# EAGLE design I2CbusTesterV1.3b (EAGLE 5.06)
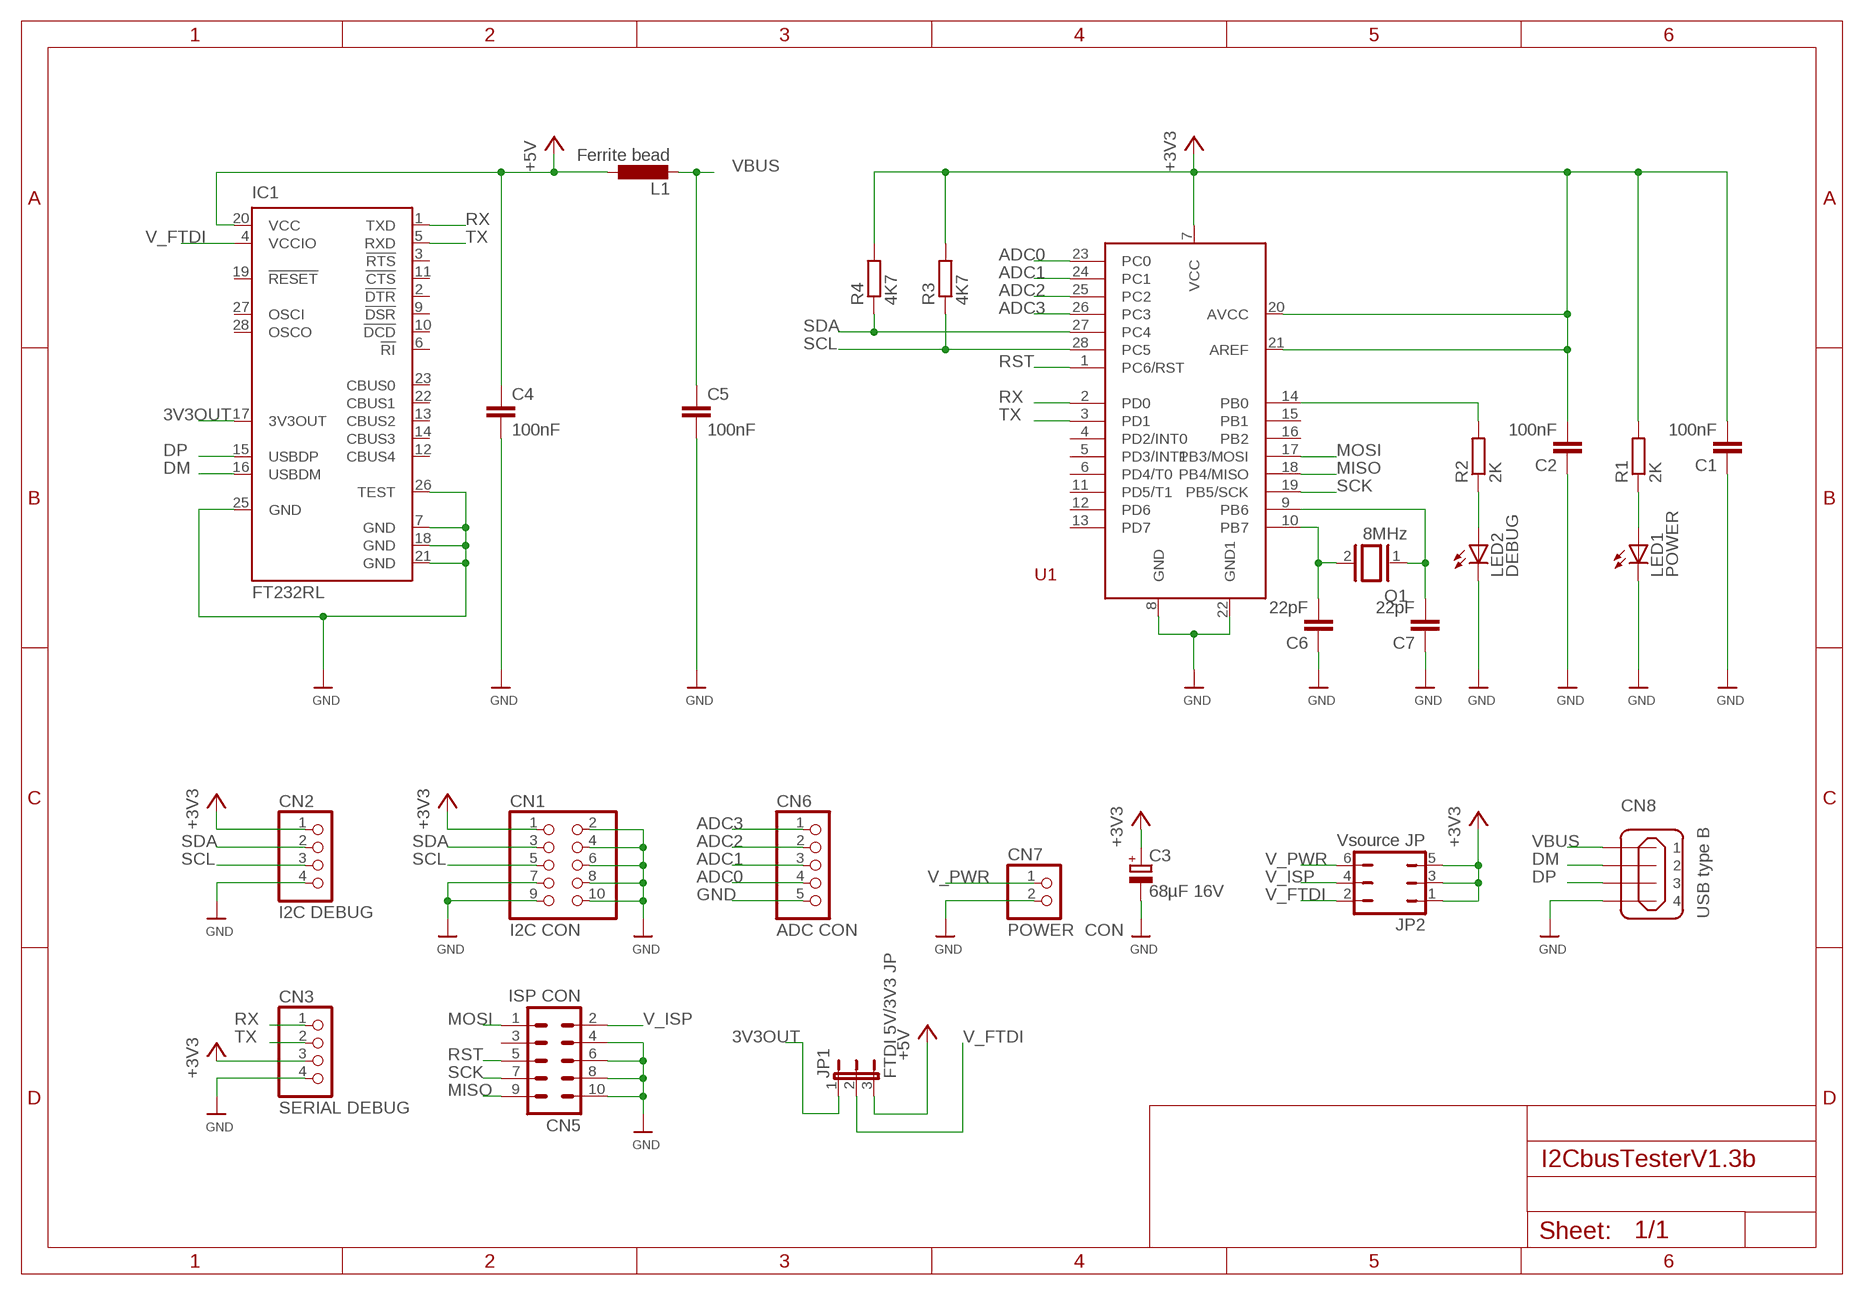
[diagram p0: schematic, sheet 1]

## Parts
C1  100nF  C-EU050-025X075  [C050-025X075]
C2  100nF  C-EU050-025X075  [C050-025X075]
C3  68µF 16V  CPOL-EUE2.5-6  [E2,5-6]
C4  100nF  C-EUC1206  [C1206]
C5  100nF  C-EUC1206  [C1206]
C6  22pF  C-EU025-025X050  [C025-025X050]
C7  22pF  C-EU025-025X050  [C025-025X050]
CN1  I2C CON  PIN1.27-2X5-  [2X05-TH1.27MM-LC]
CN2  I2C DEBUG  PINHD-1X4  [1X04]
CN3  SERIAL DEBUG  PINHD-1X4  [1X04]
CN5  ISP CON  ML10  [ML10]
CN6  ADC CON  PINHD-1X5  [1X05]
CN7  POWER CON  PINHD-1X2  [1X02]
CN8  USB type B  MINI-USB_4P-85-32004-10X  [85-32004-10X]
IC1  FT232RL  [SSOP28]
JP1  FTDI 5V/3V3 JP  JP2E  [JP2]
JP2  Vsource JP  JP3Q  [JP3Q]
L1  Ferrite bead  L-EU  [R0805W]
LED1  POWER  LED5MM  [LED5MM]
LED2  DEBUG  LED5MM  [LED5MM]
Q1  8MHz  XTAL/S  [QS]
R1  2K  R-EU_0207/10  [0207/10]
R2  2K  R-EU_0207/10  [0207/10]
R3  4K7  R-EU_0207/10  [0207/10]
R4  4K7  R-EU_0207/10  [0207/10]
U1  ATMEGA88  [AT28DIP]

## Nets
3V3OUT: IC1.17(3V3OUT) JP1.1
+3V3: C1.2 C2.2 C3.+ CN1.1 CN2.1 CN3.3 JP2.1 JP2.3 JP2.5 R1.2 R3.2 R4.2 U1.7(VCC) U1.20(AVCC) U1.21(AREF)
+5V: C4.1 IC1.20(VCC) JP1.3 L1.1
ADC0: CN6.4 U1.23(PC0)
ADC1: CN6.3 U1.24(PC1)
ADC2: CN6.2 U1.25(PC2)
ADC3: CN6.1 U1.26(PC3)
DM: CN8.2 IC1.16(USBDM)
DP: CN8.3 IC1.15(USBDP)
GND: C1.1 C2.1 C3.- C4.2 C5.2 C6.1 C7.1 CN1.2 CN1.4 CN1.6 CN1.7 CN1.8 CN1.9 CN1.10 CN2.4 CN3.4 CN5.4 CN5.6 CN5.8 CN5.10 CN6.5 CN7.2 CN8.4 IC1.7(GND) IC1.18(GND) IC1.21(GND) IC1.25(GND) IC1.26(TEST) LED1.K(C) LED2.K(C) U1.8(GND) U1.22(GND1)
MISO: CN5.9 U1.18(PB4/MISO)
MOSI: CN5.1 U1.17(PB3/MOSI)
N$2: C6.2 Q1.2 U1.10(PB7)
N$3: LED1.A R1.1
N$5: LED2.A R2.1
N$6: R2.2 U1.14(PB0)
N$9: C7.2 Q1.1 U1.9(PB6)
RST: CN5.5 U1.1(PC6/RST)
RX: CN3.1 IC1.1(TXD) U1.2(PD0)
SCK: CN5.7 U1.19(PB5/SCK)
SCL: CN1.5 CN2.3 R3.1 U1.28(PC5)
SDA: CN1.3 CN2.2 R4.1 U1.27(PC4)
TX: CN3.2 IC1.5(RXD) U1.3(PD1)
V_FTDI: IC1.4(VCCIO) JP1.2 JP2.2
V_ISP: CN5.2 JP2.4
V_PWR: CN7.1 JP2.6
VBUS: C5.1 CN8.1 L1.2
Unconnected: CN5.3 IC1.2(!DTR) IC1.3(!RTS) IC1.6(!RI) IC1.9(!DSR) IC1.10(!DCD) IC1.11(!CTS) IC1.12(CBUS4) IC1.13(CBUS2) IC1.14(CBUS3) IC1.19(!RESET) IC1.22(CBUS1) IC1.23(CBUS0) IC1.27(OSCI) IC1.28(OSCO) U1.4(PD2/INT0) U1.5(PD3/INT1) U1.6(PD4/T0) U1.11(PD5/T1) U1.12(PD6) U1.13(PD7) U1.15(PB1) U1.16(PB2)

## Library data of the parts
C1 C2 C4-C7 = rcl:C-EU: CAPACITOR, European symbol
C3 = rcl:CPOL-EU: POLARIZED CAPACITOR, European symbol
CN1 = my_lib:PIN1.27-2X5-: HARWIN Female-to-Male IDC Ribbon Cable Assembly 1.27mm Pitch DIL 10 Contacts, 2 rows
CN2 CN3 = pinhead:PINHD-1X4: PIN HEADER
CN5 = con-harting-ml:ML10: HARTING
CN6 = pinhead:PINHD-1X5: PIN HEADER
CN7 = pinhead:PINHD-1X2: PIN HEADER
CN8 = con-cypressindustries:MINI-USB_4P-: MINI USB 4 Pol. Source: www.cypressindustries.com
IC1 = ftdichip:FT232R: Source: http://www.ftdichip.com/Documents/DataSheets/DS_FT232R_v104.pdf
JP1 = jumper:JP2E: JUMPER
JP2 = jumper:JP3Q: JUMPER
L1 = rcl:L-EU: INDUCTOR, European symbol
LED1 LED2 = led:LED: LED OSRAM: - CHIPLED LG R971, LG N971, LY N971, LG Q971, LY Q971, LO R971, LY R971 LH N974, LH R974 LS Q976, LO Q976, LY Q976 LO Q996 - Hyper CHIPLED LW Q18S LB Q993, LB Q99A, LB R99A - SideLED LS A670, LO A670, LY A670, LG A670, LP A670 LB A673, LV A673, LT A673, LW A673 LH A674 LY A675 LS A676, LA A676, LO A676, LY A676, LW A676 LS A679, LY A679, LG A679 - Hyper Micro SIDELED® LS Y876, LA Y876, LO Y876, LY Y876 LT Y87S - SmartLED LW L88C, LW L88S LB L89C, LB L89S, LG L890 LS L89K, LO L89K, LY L89K LS L896, LA L896, LO L896, LY L896 - TOPLED LS T670, LO T670, LY T670, LG T670, LP T670 LSG T670, LSP T670, LSY T670, LOP T670, LYG T670 LG T671, LOG T671, LSG T671 LB T673, LV T673, LT T673, LW T673 LH T674 LS T676, LA T676, LO T676, LY T676, LB T676, LH T676, LSB T676, LW T676 LB T67C, LV T67C, LT T67C, LS T67K, LO T67K, LY T67K, LW E67C LS E67B, LA E67B, LO E67B, LY E67B, LB E67C, LV E67C, LT E67C LW T67C LS T679, LY T679, LG T679 LS T770, LO T770, LY T770, LG T770, LP T770 LB T773, LV T773, LT T773, LW T773 LH T774 LS E675, LA E675, LY E675, LS T675 LS T776, LA T776, LO T776, LY T776, LB T776 LHGB T686 LT T68C, LB T68C - Hyper Mini TOPLED® LB M676 - Mini TOPLED Santana® LG M470 LS M47K, LO M47K, LY M47K Source: http://www.osram.convergy.de LUXEON: - LUMILED® LXK2-PW12-R00, LXK2-PW12-S00, LXK2-PW14-U00, LXK2-PW14-V00 LXK2-PM12-R00, LXK2-PM12-S00, LXK2-PM14-U00 LXK2-PE12-Q00, LXK2-PE12-R00, LXK2-PE12-S00, LXK2-PE14-T00, LXK2-PE14-U00 LXK2-PB12-K00, LXK2-PB12-L00, LXK2-PB12-M00, LXK2-PB14-N00, LXK2-PB14-P00, LXK2-PB14-Q00 LXK2-PR12-L00, LXK2-PR12-M00, LXK2-PR14-Q00, LXK2-PR14-R00 LXK2-PD12-Q00, LXK2-PD12-R00, LXK2-PD12-S00 LXK2-PH12-R00, LXK2-PH12-S00 LXK2-PL12-P00, LXK2-PL12-Q00, LXK2-PL12-R00 Source: www.luxeon.com KINGBRIGHT: KA-3528ASYC Source: www.kingbright.com
Q1 = special:XTAL/S: CRYSTAL
R1-R4 = rcl:R-EU_: RESISTOR, European symbol
U1 = my_lib:ATMEGA88

## Board
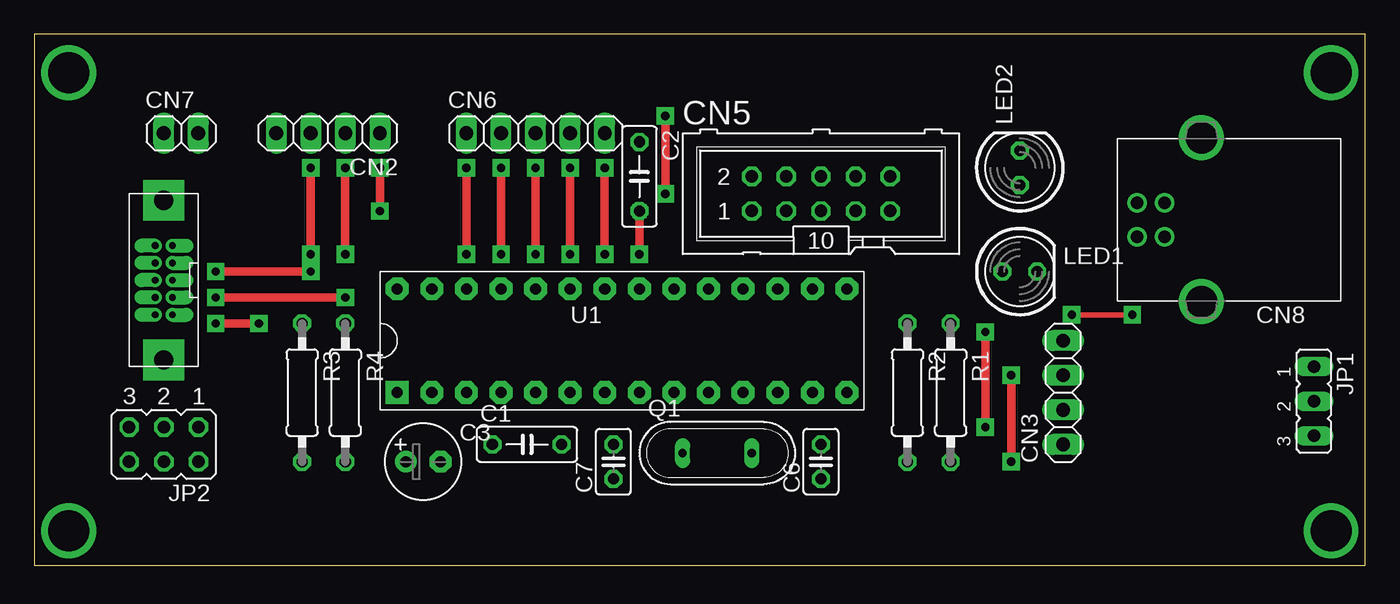
[diagram p1: board, top side]
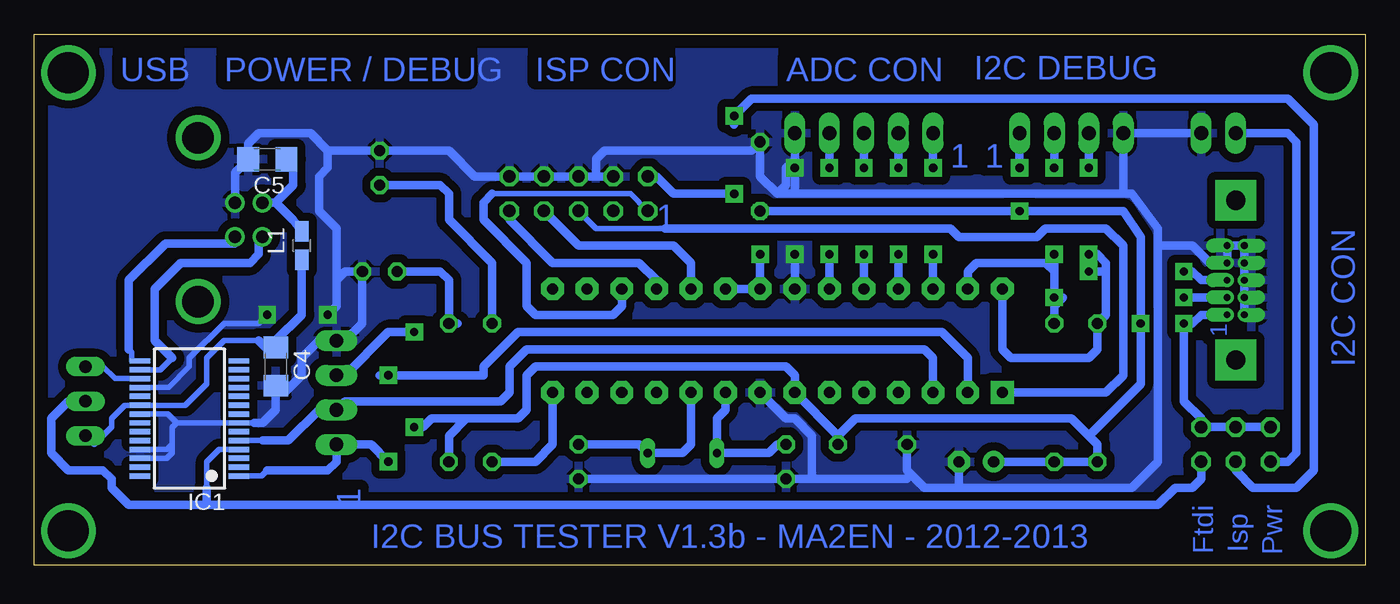
[diagram p2: board, bottom side, seen from below]

Size 97.77 x 39.04 mm. Coordinates in mm from the lower left corner, seen from the top.
Outline: 0,0 97.77,0 97.77,39.04 0,39.04 0,0
Copper layers (1*16): Top 0.035mm / dielectric 1.5mm / Bottom 0.035mm
Design rules "default": minimum track width 10mil, minimum drill 24mil, track to track 8mil, track to pad 8mil, pad to pad 8mil, via to via 8mil, smd to smd 8mil, copper to edge 40mil, drill to drill 8mil, minimum pad ring 10mil, minimum via ring 8mil, stop-mask expansion 4mil, vias tented up to drill 0mil, thermal gap 10mil

### Footprints (pad centres in the part's own frame; a part is rotated, then mirrored left to right if it is on the bottom)
C050-025X075 = drill 0.813 octagon: 1 -2.54,0; 2 2.54,0
E2,5-6 = drill 0.813 pad 1.6 round: + -1.27,0 | drill 0.813 pad 1.6 octagon: - 1.27,0
C1206 = smd 1.6 x 1.8: 1 -1.4,0; 2 1.4,0
C025-025X050 = drill 0.813 octagon: 1 -1.27,0; 2 1.27,0
2X05-TH1.27MM-LC = drill 0.5 pad 1.016 offset: 1 -2.54,-0.635; 2 -2.54,0.635; 3 -1.27,-0.635; 4 -1.27,0.635; 5 0,-0.635; 6 0,0.635; 7 1.27,-0.635; 8 1.27,0.635; 9 2.54,-0.635; 10 2.54,0.635 | drill 1.4 pad 3 square: P$11 -5.867,0; P$12 5.867,0
1X04 = drill 1.016 long: 1 -3.81,0; 2 -1.27,0; 3 1.27,0; 4 3.81,0
ML10 = drill 0.914 octagon: 1 -5.08,-1.27; 2 -5.08,1.27; 3 -2.54,-1.27; 4 -2.54,1.27; 5 0,-1.27; 6 0,1.27; 7 2.54,-1.27; 8 2.54,1.27; 9 5.08,-1.27; 10 5.08,1.27
1X05 = drill 1.016 long: 1 -5.08,0; 2 -2.54,0; 3 0,0; 4 2.54,0; 5 5.08,0
1X02 = drill 1.016 long: 1 -1.27,0; 2 1.27,0
85-32004-10X = drill 0.92 pad 1.27 round: 1 4.71,-1.25; 2 4.71,1.25; 3 2.71,1.25; 4 2.71,-1.25 | drill 2.3 pad 3 round: M1 0,6.02; M2 0,-6.02
SSOP28 = smd 0.4 x 1.5: 1 -4.225,-3.625; 2 -3.575,-3.625; 3 -2.925,-3.625; 4 -2.275,-3.625; 5 -1.625,-3.625; 6 -0.975,-3.625; 7 -0.325,-3.625; 8 0.325,-3.625; 9 0.975,-3.625; 10 1.625,-3.625; 11 2.275,-3.625; 12 2.925,-3.625; 13 3.575,-3.625; 14 4.225,-3.625; 15 4.225,3.625; 16 3.575,3.625; 17 2.925,3.625; 18 2.275,3.625; 19 1.625,3.625; 20 0.975,3.625; 21 0.325,3.625; 22 -0.325,3.625; 23 -0.975,3.625; 24 -1.625,3.625; 25 -2.275,3.625; 26 -2.925,3.625; 27 -3.575,3.625; 28 -4.225,3.625
JP2 = drill 0.914 long: 1 -2.54,0; 2 0,0; 3 2.54,0
JP3Q = drill 0.914 octagon: 1 -2.54,-1.27; 2 -2.54,1.27; 3 0,-1.27; 4 0,1.27; 5 2.54,-1.27; 6 2.54,1.27
R0805W = smd 1.5 x 1: 1 -1.052,0; 2 1.052,0
LED5MM = drill 0.813 octagon: A -1.27,0; K 1.27,0
QS = drill 0.61 long: 1 -2.54,0; 2 2.54,0
0207/10 = drill 0.813 octagon: 1 -5.08,0; 2 5.08,0
AT28DIP = drill 0.813 pad 1.676 square: 1 -16.51,-3.81 | drill 0.813 pad 1.676 octagon: 2 -13.97,-3.81; 3 -11.43,-3.81; 4 -8.89,-3.81; 5 -6.35,-3.81; 6 -3.81,-3.81; 7 -1.27,-3.81; 8 1.27,-3.81; 9 3.81,-3.81; 10 6.35,-3.81; 11 8.89,-3.81; 12 11.43,-3.81; 13 13.97,-3.81; 14 16.51,-3.81; 15 16.51,3.81; 16 13.97,3.81; 17 11.43,3.81; 18 8.89,3.81; 19 6.35,3.81; 20 3.81,3.81; 21 1.27,3.81; 22 -1.27,3.81; 23 -3.81,3.81; 24 -6.35,3.81; 25 -8.89,3.81; 26 -11.43,3.81; 27 -13.97,3.81; 28 -16.51,3.81

### Placement (x,y rotation side)
C1  36.2,8.89 0 top
C2  44.45,28.57 270 top
C3  28.57,7.62 0 top
C4  80.01,14.61 270 bottom
C5  80.64,29.84 180 bottom
C6  57.78,7.62 90 top
C7  42.55,7.62 90 top
CN1  9.53,20.95 90 top
CN2  21.59,31.75 180 top
CN3  75.56,12.7 90 top
CN5  57.78,27.3 0 top
CN6  36.83,31.75 0 top
CN7  10.79,31.75 0 top
CN8  85.72,25.4 180 top
IC1  86.36,10.79 90 bottom
JP1  93.98,12.06 270 top
JP2  9.53,8.89 180 top
L1  78.11,23.5 90 bottom
LED1  72.39,21.59 0 top
LED2  72.39,29.21 90 top
Q1  50.16,8.26 0 top
R1  67.31,12.7 270 top
R2  64.14,12.7 270 top
R3  19.68,12.7 270 top
R4  22.86,12.7 270 top
U1  43.18,16.51 0 top

### Tracks (layer width: path | path; a pad name or v marks a point on that pad's centre or on a via)
3V3OUT
  Bottom 0.406: IC1.17 91.83,13.72 92.71,14.61 JP1.1
+3V3  (via drill 0.6 pad 1.02, 0.6 pad 1.27)
  Top 0.61: C2.2 v44.45,22.86 | v25.4,26.04 v25.4,29.21 | v13.34,17.78 v16.51,17.78 | v69.85,10.16 v69.85,17.14
  Bottom 0.406: CN3.3 75.94,13.6
  Bottom 0.61: 20.32,9.53 16.51,13.34 v16.51,17.78 16.51,24.13 17.78,26.04 v25.4,26.04 C2.2 | 20.32,9.53 19.68,8.89 R3.2 R4.2 C3.+ | v44.45,22.86 U1.21 U1.20 | v25.4,29.21 CN2.1 | CN1.1 12.06,18.41 12.7,17.78 v13.34,17.78 13.34,12.06 12.06,10.79 JP2.1 JP2.3 JP2.5 | 66.04,10.79 62.23,10.79 61.59,11.43 61.59,13.97 60.96,14.61 42.55,14.61 41.91,13.97 U1.7 38.73,9.53 | R1.2 67.31,9.53 66.04,10.79 | 66.04,10.79 68.58,10.79 69.22,10.16 v69.85,10.16 | 20.32,9.53 21.59,10.79 37.47,10.79 38.73,9.53 | CN3.3 74.93,13.97 71.75,17.14 v69.85,17.14 | 38.73,9.53 C1.2
  other vias: 44.45,26.04
+5V
  Bottom 0.406: JP1.3 93.34,8.89 92.08,10.16 92.08,10.79 91.1,11.77 IC1.20 86.66,11.77 85.09,13.34 85.09,15.24 83.82,16.51 81.28,16.51
  Bottom 0.61: 78.11,22.86 L1.1 78.11,18.41 80.01,16.51 C4.1 80.78,16 81.28,16.51
ADC0  (via drill 0.6 pad 1.27)
  Top 0.61: v39.37,22.86 v39.37,29.21
  Bottom 0.61: U1.23 v39.37,22.86 | v39.37,29.21 CN6.4
ADC1  (via drill 0.6 pad 1.27)
  Top 0.61: v36.83,22.86 v36.83,29.21
  Bottom 0.61: U1.24 v36.83,22.86 | v36.83,29.21 CN6.3
ADC2  (via drill 0.6 pad 1.27)
  Top 0.61: v34.29,22.86 v34.29,29.21
  Bottom 0.61: v34.29,29.21 CN6.2 | U1.25 v34.29,22.86
ADC3  (via drill 0.6 pad 1.27)
  Top 0.61: v31.75,22.86 v31.75,29.21
  Bottom 0.61: U1.26 v31.75,22.86 | v31.75,29.21 CN6.1
DM
  Bottom 0.406: IC1.16 88.5,14.37 87.63,15.24
  Bottom 0.61: CN8.2 81.28,23.89 81.28,22.86 81.92,22.23 87,22.23 88.9,20.32 88.9,16.51 87.63,15.24
DP
  Bottom 0.406: IC1.15 90.58,15.02 90.58,15.65 90.81,15.88
  Bottom 0.61: CN8.3 83.03,24.13 83.03,23.64 88.11,23.64 90.81,20.95 90.81,15.88
GND  (via drill 0.6 pad 1.27)
  Top 0.406: v76.2,18.41 v80.64,18.41
  Top 0.61: v41.91,29.21 v41.91,22.86
  Bottom 0.406: 87.31,10.47 IC1.7 81.61,10.47 | 87.31,10.47 87.63,10.79 87.63,10.81 87.94,11.12 IC1.21 | IC1.25 88,8.52 87.63,8.89 | 87.63,8.89 87.63,10.14 87.31,10.47 | IC1.26 88.02,7.87 87.63,8.26 87.63,8.89 | IC1.18 87.89,13.07 86.36,14.61 86.36,15.24 83.82,17.78 81.28,17.78 v80.64,18.41
  Bottom 0.61: 56.52,28.57 CN5.4 | 56.52,28.57 CN5.6 CN5.8 CN5.10 65.41,28.57 67.31,30.48 LED2.K 76.2,30.48 | 17.78,27.3 41.91,27.3 | 41.91,27.3 v41.91,29.21 41.91,29.84 | v41.91,22.86 U1.22 | 41.91,29.84 CN6.5 | 17.78,27.3 CN2.4 CN7.2 | 15.24,23.5 12.7,23.5 11.43,22.23 CN1.7 CN1.9 CN1.10 CN1.8 CN1.6 CN1.4 CN1.2 | 17.78,27.3 17.14,27.3 15.24,24.77 15.24,23.5 | 41.91,29.84 42.55,29.21 42.55,27.94 43.18,27.3 | 56.52,28.57 56.52,29.84 55.88,30.48 45.09,30.48 C2.1 44.45,28.57 43.18,27.3 | CN8.4 83.02,28.88 C5.2 82.05,30.98 81.28,31.75 77.47,31.75 76.2,30.48 | 76.2,30.48 76.2,29.21 76.83,28.57 76.83,26.04 75.56,24.77 75.56,20.95 | 15.24,23.5 15.24,7.62 17.14,5.71 29.84,5.71 | 29.84,5.71 C3.- | 75.56,20.95 74.93,21.59 LED1.K 73.66,17.78 74.93,16.51 CN3.4 76.83,16.51 78.11,15.24 78.11,13.97 79.38,12.7 C4.2 80.01,11.43 80.97,10.47 81.61,10.47 | 41.91,27.3 43.18,27.3 | 29.84,5.71 32.38,5.71 33.34,6.67 | 33.34,6.67 33.66,6.99 C1.1 | U1.8 42.55,10.79 41.91,10.79 40.64,9.53 40.64,6.35 | 40.64,6.35 33.66,6.35 33.34,6.67 | 40.64,6.35 C7.1 C6.1 | 75.56,20.95 75.56,19.05 v76.2,18.41
  pour Bottom (isolate 0.61): 0,38.73 0,0 97.79,0 97.79,38.73
MISO
  Bottom 0.61: U1.18 52.07,20.95 53.34,22.23 59.69,22.23 62.87,25.4 CN5.9
MOSI
  Bottom 0.406: 64.14,27.3 53.98,27.3 CN5.1
  Bottom 0.61: U1.17 54.61,19.05 55.24,18.41 60.96,18.41 61.59,19.05 61.59,22.23 64.77,25.4 64.77,26.67 64.14,27.3
N$1  (via drill 3 pad 3.81)
  other vias: 2.54,36.2
N$2
  Bottom 0.61: U1.10 49.53,8.89 50.16,8.26 Q1.2 53.34,8.89 C6.2
N$3
  Bottom 0.61: 66.67,17.78 R1.1 67.31,20.95 67.94,21.59 LED1.A
N$4  (via drill 3 pad 3.81)
  other vias: 95.25,36.2
N$5
  Bottom 0.61: R2.1 64.14,22.23 67.31,25.4 67.31,27.3 67.94,27.94 LED2.A
N$6
  Bottom 0.61: R2.2 60.96,7.62 59.69,8.89 U1.14
N$7  (via drill 3 pad 3.81)
  other vias: 2.54,2.54
N$8  (via drill 3 pad 3.81)
  other vias: 95.25,2.54
N$9
  Bottom 0.61: C7.2 43.18,8.89 43.81,8.26 Q1.1 47.62,10.79 46.99,11.43 U1.9
RST
  Bottom 0.406: 51.44,24.77 56.52,24.77 CN5.5
  Bottom 0.61: U1.1 19.05,12.7 17.78,13.97 17.78,23.5 19.05,24.77 23.5,24.77 24.13,24.13 29.84,24.13 30.48,24.77 51.44,24.77
RX  (via drill 0.6 pad 1.27)
  Top 0.61: v71.75,13.97 v71.75,7.62
  Bottom 0.406: IC1.1 81.06,6.57 80.64,6.99
  Bottom 0.61: U1.2 29.21,15.24 31.11,17.14 62.23,17.14 64.77,14.61 64.77,13.97 v71.75,13.97 72.39,13.97 | v71.75,7.62 73.03,8.89 CN3.1 75.56,7.62 76.2,6.99 80.64,6.99
SCK
  Bottom 0.61: U1.19 49.53,22.23 50.8,23.5 57.78,23.5 CN5.7
SCL  (via drill 0.6 pad 1.27)
  Top 0.61: v20.32,22.86 v20.32,29.21 | v13.34,21.59 v20.32,21.59
  Bottom 0.61: v20.32,29.21 CN2.3 | U1.28 26.67,15.88 26.04,15.24 20.32,15.24 19.68,15.88 R3.1 19.05,18.41 19.05,21.59 | CN1.5 12.06,20.95 12.7,21.59 v13.34,21.59 | v20.32,21.59 19.05,21.59 | v20.32,22.86 19.68,22.86 19.05,22.23 19.05,21.59
SDA  (via drill 0.6 pad 1.27)
  Top 0.61: v22.86,22.86 v22.86,29.21 | v13.34,19.68 v22.86,19.68
  Bottom 0.61: 22.86,19.05 R4.1 | 22.86,19.05 22.86,21.59 | 22.86,21.59 v22.86,22.86 | v22.86,29.21 CN2.2 | U1.27 29.21,21.59 28.57,22.23 23.5,22.23 22.86,21.59 | CN1.3 v13.34,19.68 | v22.86,19.68 22.23,19.68 22.86,19.05
TX
  Bottom 0.406: 81,9.17 IC1.5
  Bottom 0.61: U1.3 31.75,15.24 32.38,15.88 61.59,15.88 62.87,14.61 62.87,12.7 63.5,12.06 74.93,12.06 CN3.2 76.83,11.43 79.09,9.17 81,9.17
V_FTDI
  Bottom 0.406: 85.09,5.71 85.09,7.62 84.19,8.52 IC1.4
  Bottom 0.61: JP2.2 12.06,6.35 12.7,5.71 13.97,5.71 15.24,4.45 85.09,4.45 | JP1.2 95.25,12.06 96.52,10.79 96.52,8.26 95.25,6.99 92.71,6.99 92.08,6.35 92.08,5.71 90.81,4.45 85.09,4.45 | 85.09,4.45 85.09,5.71
V_ISP  (via drill 0.6 pad 1.27)
  Top 0.61: v46.35,33.02 v46.35,27.3
  Bottom 0.61: CN5.2 52.07,28.57 50.8,27.3 v46.35,27.3 | 46.35,32.38 v46.35,33.02 45.09,34.29 5.71,34.29 3.81,32.38 3.81,6.99 5.08,5.71 8.26,5.71 9.53,6.99 JP2.4
V_PWR
  Bottom 0.61: JP2.6 5.71,7.62 5.08,8.26 5.08,31.11 5.71,31.75 CN7.1
VBUS
  Bottom 0.61: 80.03,26.65 CN8.1 | 80.03,26.65 78.74,27.94 78.74,29.84 C5.1 | L1.2 78.74,25.36 80.03,26.65

### Text on the board
Bottom: I2C DEBUG | ADC CON | ISP CON | POWER / DEBUG | USB | 1 | 1 | I2C CON | 1 | 1 | Pwr | Isp | Ftdi | I2C BUS TESTER V1.3b - MA2EN - 2012-2013